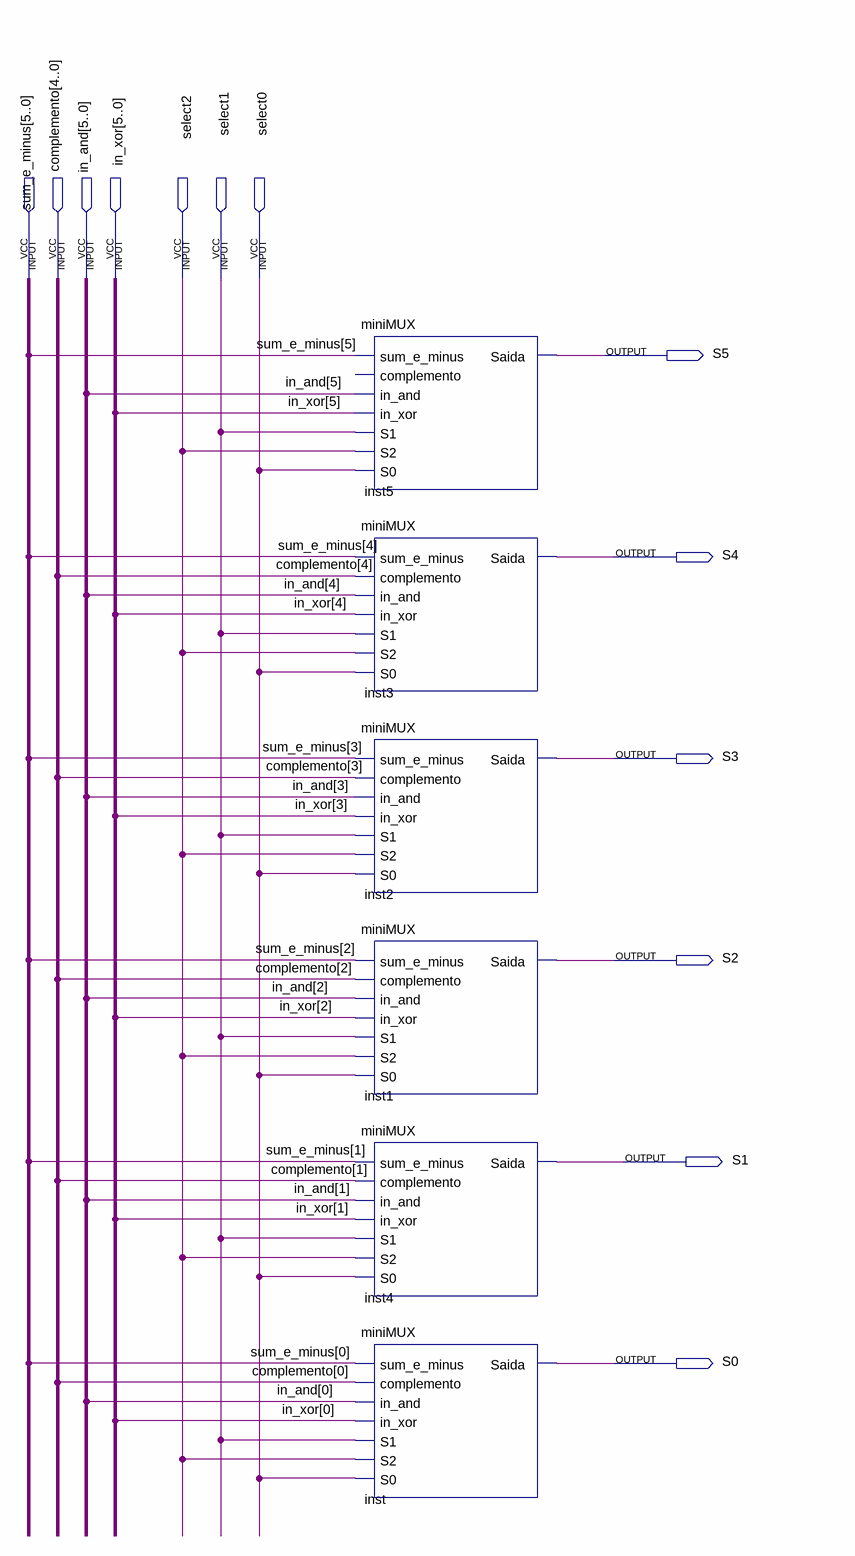
[diagram p0: schematic sheet]
// Quartus schematic MUXseletor.bdf as structural Verilog: 6 symbols, 13 pins
module MUXseletor (
  input  [5:0] sum_e_minus,
  input  [4:0] complemento,
  input  [5:0] in_and,
  input  [5:0] in_xor,
  input  select2,
  input  select1,
  input  select0,
  output S5,
  output S4,
  output S3,
  output S2,
  output S1,
  output S0
);

  miniMUX inst5 (
    .sum_e_minus(sum_e_minus[5]), .in_and(in_and[5]), .in_xor(in_xor[5]), .S1(select1), .S2(select2),
    .S0(select0), .Saida(S5));  // open: complemento
  miniMUX inst3 (
    .sum_e_minus(sum_e_minus[4]), .complemento(complemento[4]), .in_and(in_and[4]), .in_xor(in_xor[4]),
    .S1(select1), .S2(select2), .S0(select0), .Saida(S4));
  miniMUX inst2 (
    .sum_e_minus(sum_e_minus[3]), .complemento(complemento[3]), .in_and(in_and[3]), .in_xor(in_xor[3]),
    .S1(select1), .S2(select2), .S0(select0), .Saida(S3));
  miniMUX inst1 (
    .sum_e_minus(sum_e_minus[2]), .complemento(complemento[2]), .in_and(in_and[2]), .in_xor(in_xor[2]),
    .S1(select1), .S2(select2), .S0(select0), .Saida(S2));
  miniMUX inst4 (
    .sum_e_minus(sum_e_minus[1]), .complemento(complemento[1]), .in_and(in_and[1]), .in_xor(in_xor[1]),
    .S1(select1), .S2(select2), .S0(select0), .Saida(S1));
  miniMUX inst (
    .sum_e_minus(sum_e_minus[0]), .complemento(complemento[0]), .in_and(in_and[0]), .in_xor(in_xor[0]),
    .S1(select1), .S2(select2), .S0(select0), .Saida(S0));
endmodule
